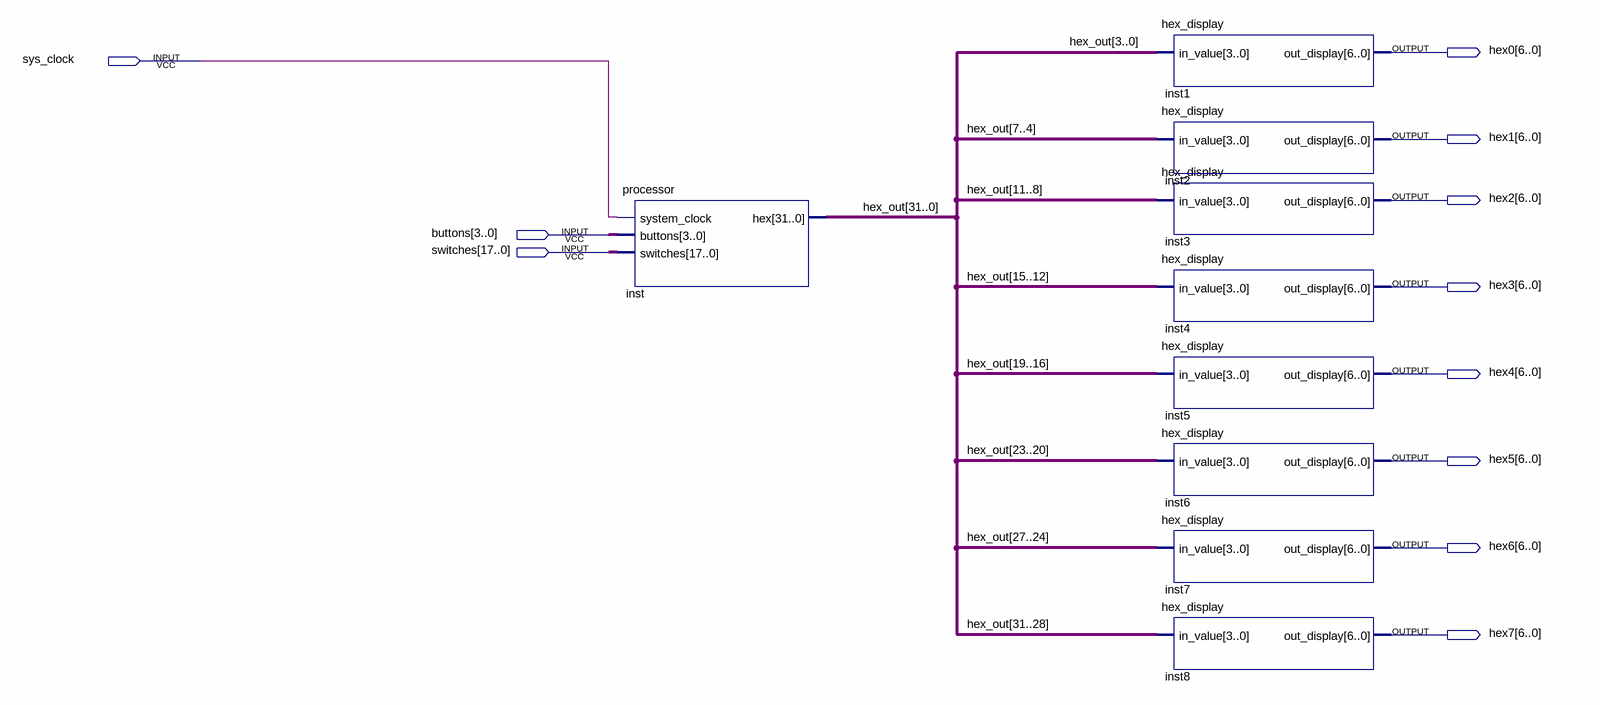
[diagram p0: schematic sheet]
// Quartus schematic quanta.bdf as structural Verilog: 9 symbols, 11 pins
module quanta (
  input  sys_clock,
  input  [3:0] buttons,
  input  [17:0] switches,
  output [6:0] hex0,
  output [6:0] hex1,
  output [6:0] hex2,
  output [6:0] hex3,
  output [6:0] hex4,
  output [6:0] hex5,
  output [6:0] hex6,
  output [6:0] hex7
);

  wire [31:0] hex_out;

  processor inst (.system_clock(sys_clock), .buttons(buttons), .switches(switches), .hex(hex_out));
  hex_display inst1 (.in_value(hex_out[3:0]), .out_display(hex0));
  hex_display inst2 (.in_value(hex_out[7:4]), .out_display(hex1));
  hex_display inst3 (.in_value(hex_out[11:8]), .out_display(hex2));
  hex_display inst4 (.in_value(hex_out[15:12]), .out_display(hex3));
  hex_display inst5 (.in_value(hex_out[19:16]), .out_display(hex4));
  hex_display inst6 (.in_value(hex_out[23:20]), .out_display(hex5));
  hex_display inst7 (.in_value(hex_out[27:24]), .out_display(hex6));
  hex_display inst8 (.in_value(hex_out[31:28]), .out_display(hex7));
endmodule
